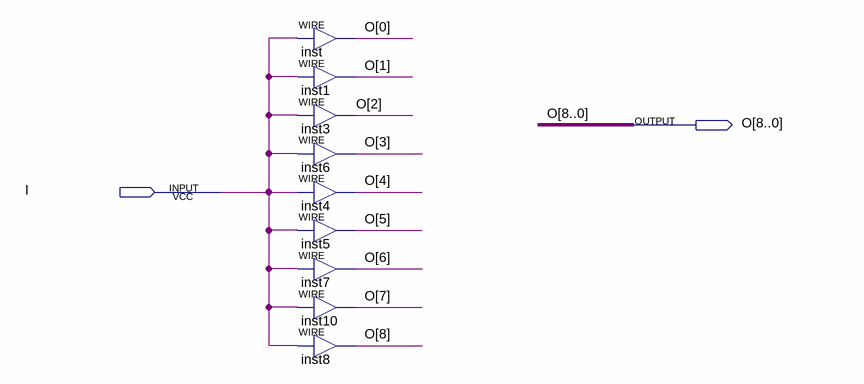
[diagram p0: schematic sheet]
// Quartus schematic Extend9.bdf as structural Verilog: 9 symbols, 2 pins
module Extend9 (
  input  I,
  output [8:0] O
);

  assign O[0] = I;  // WIRE inst
  assign O[1] = I;  // WIRE inst1
  assign O[2] = I;  // WIRE inst3
  assign O[3] = I;  // WIRE inst6
  assign O[4] = I;  // WIRE inst4
  assign O[5] = I;  // WIRE inst5
  assign O[6] = I;  // WIRE inst7
  assign O[7] = I;  // WIRE inst10
  assign O[8] = I;  // WIRE inst8
endmodule
